# EAGLE design Nixius (EAGLE 7.1.0)
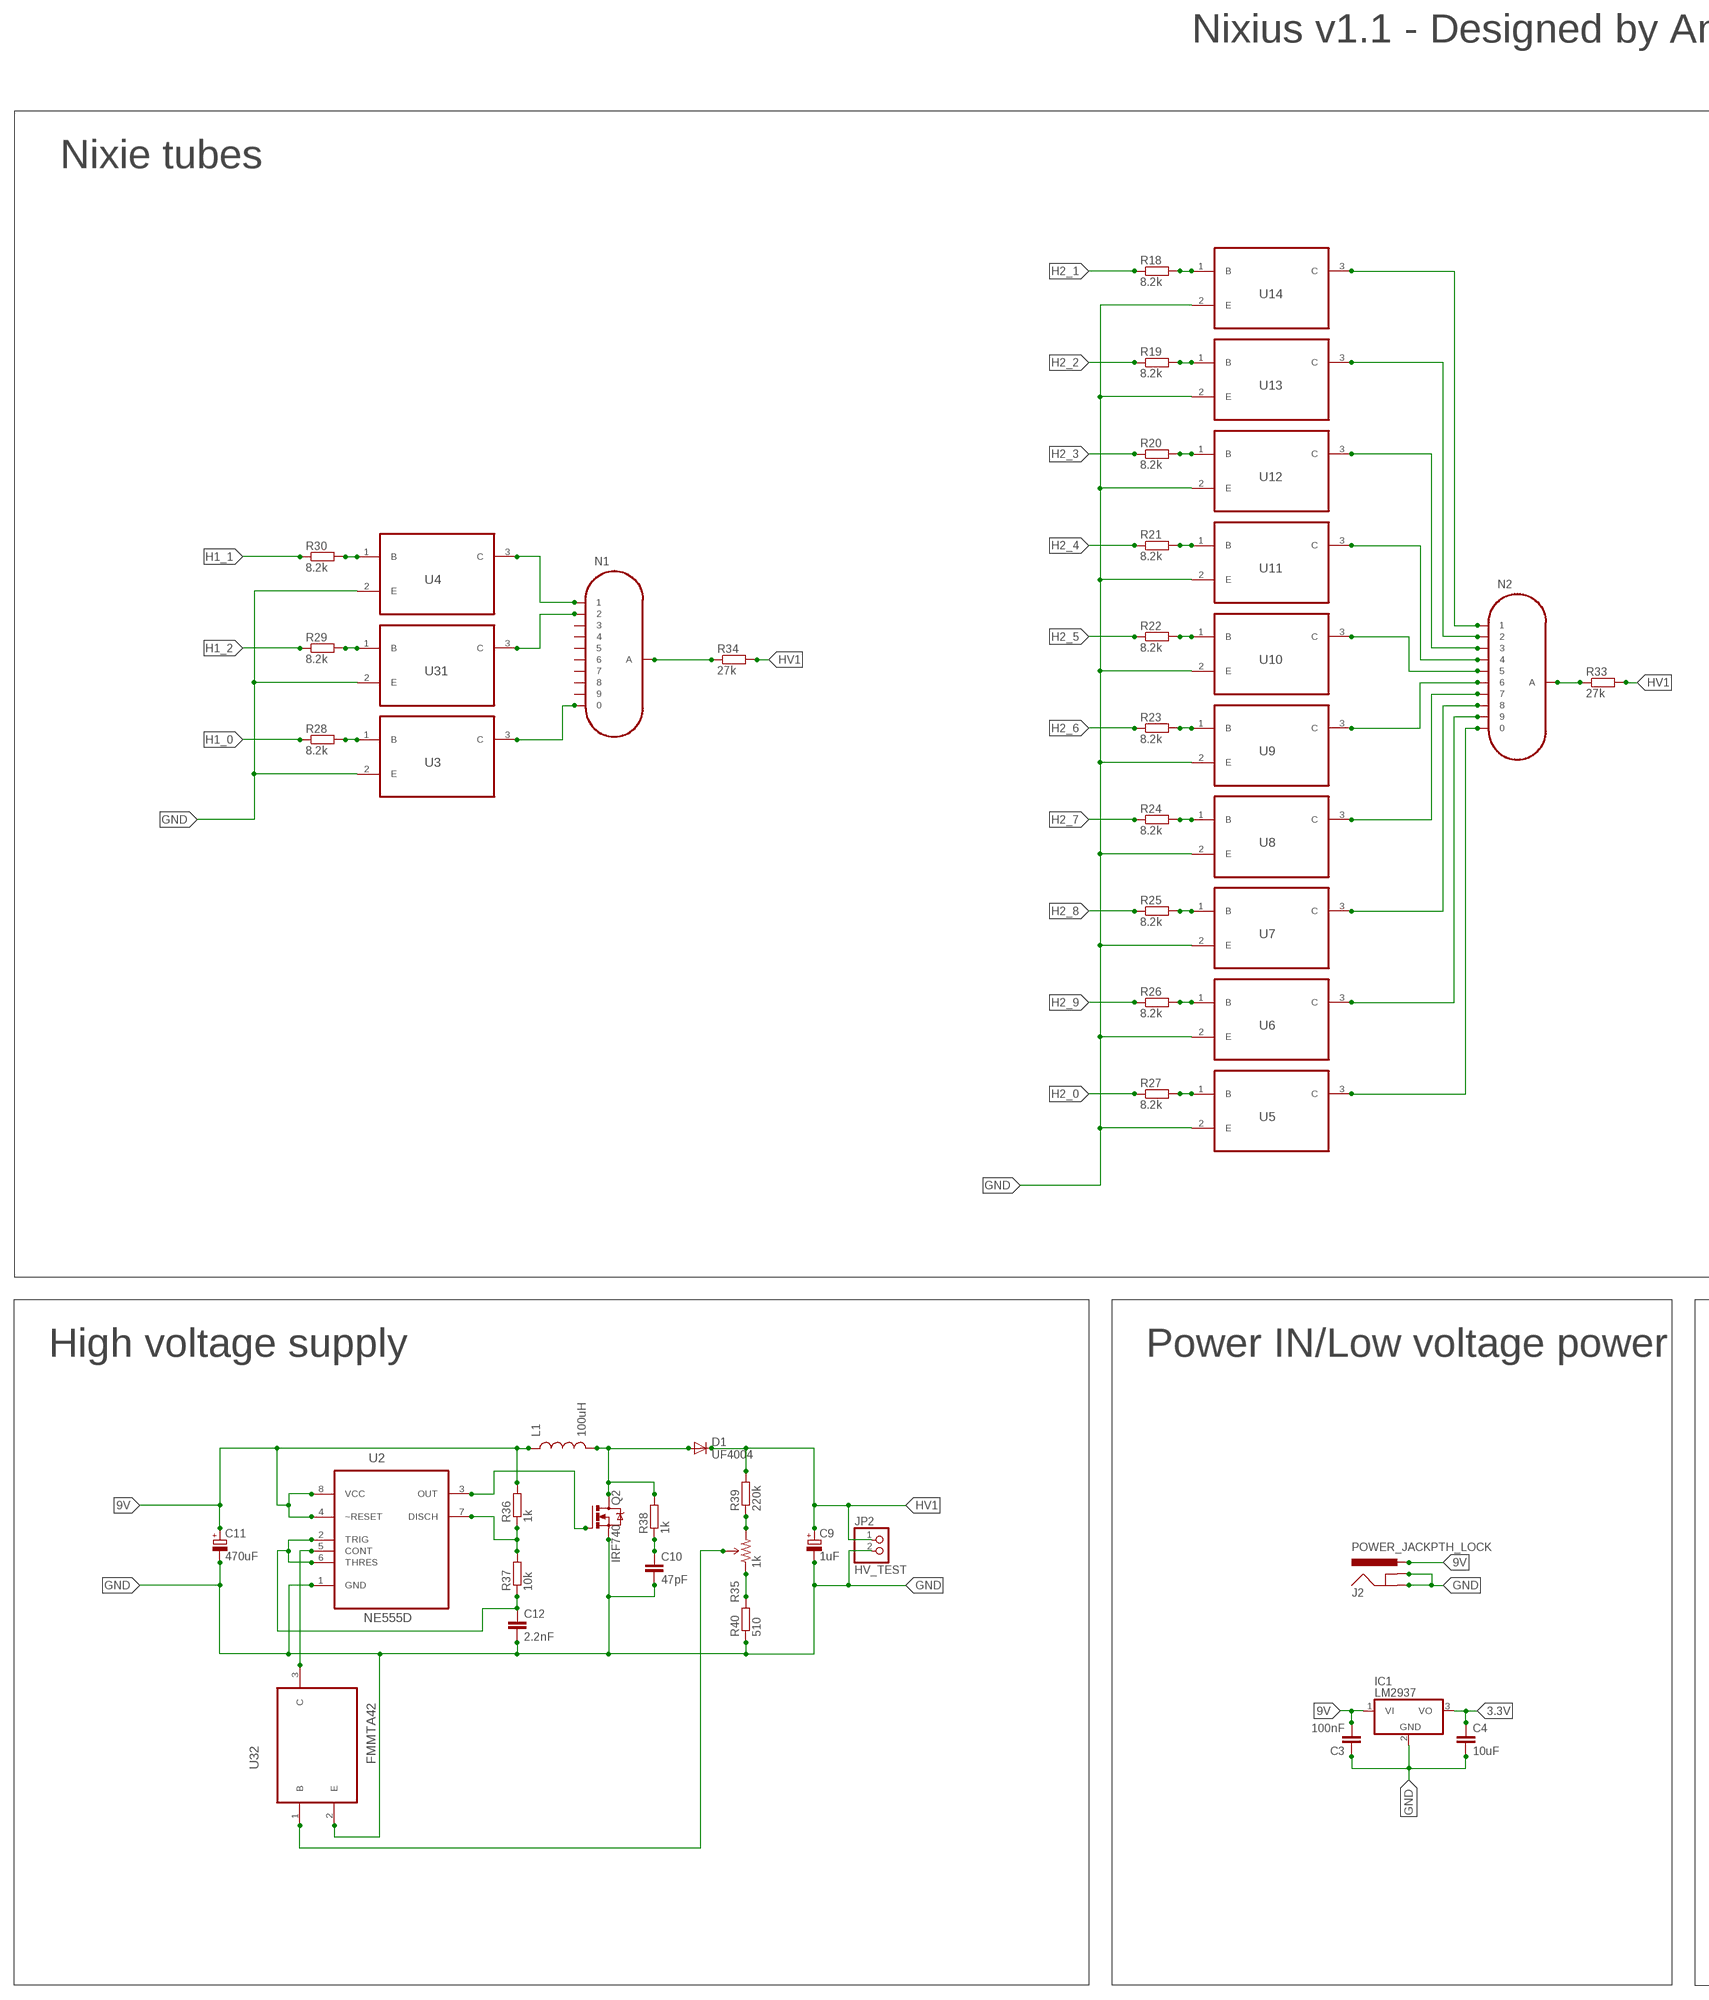
[diagram p0: schematic, sheet 1, part 1 of 2]
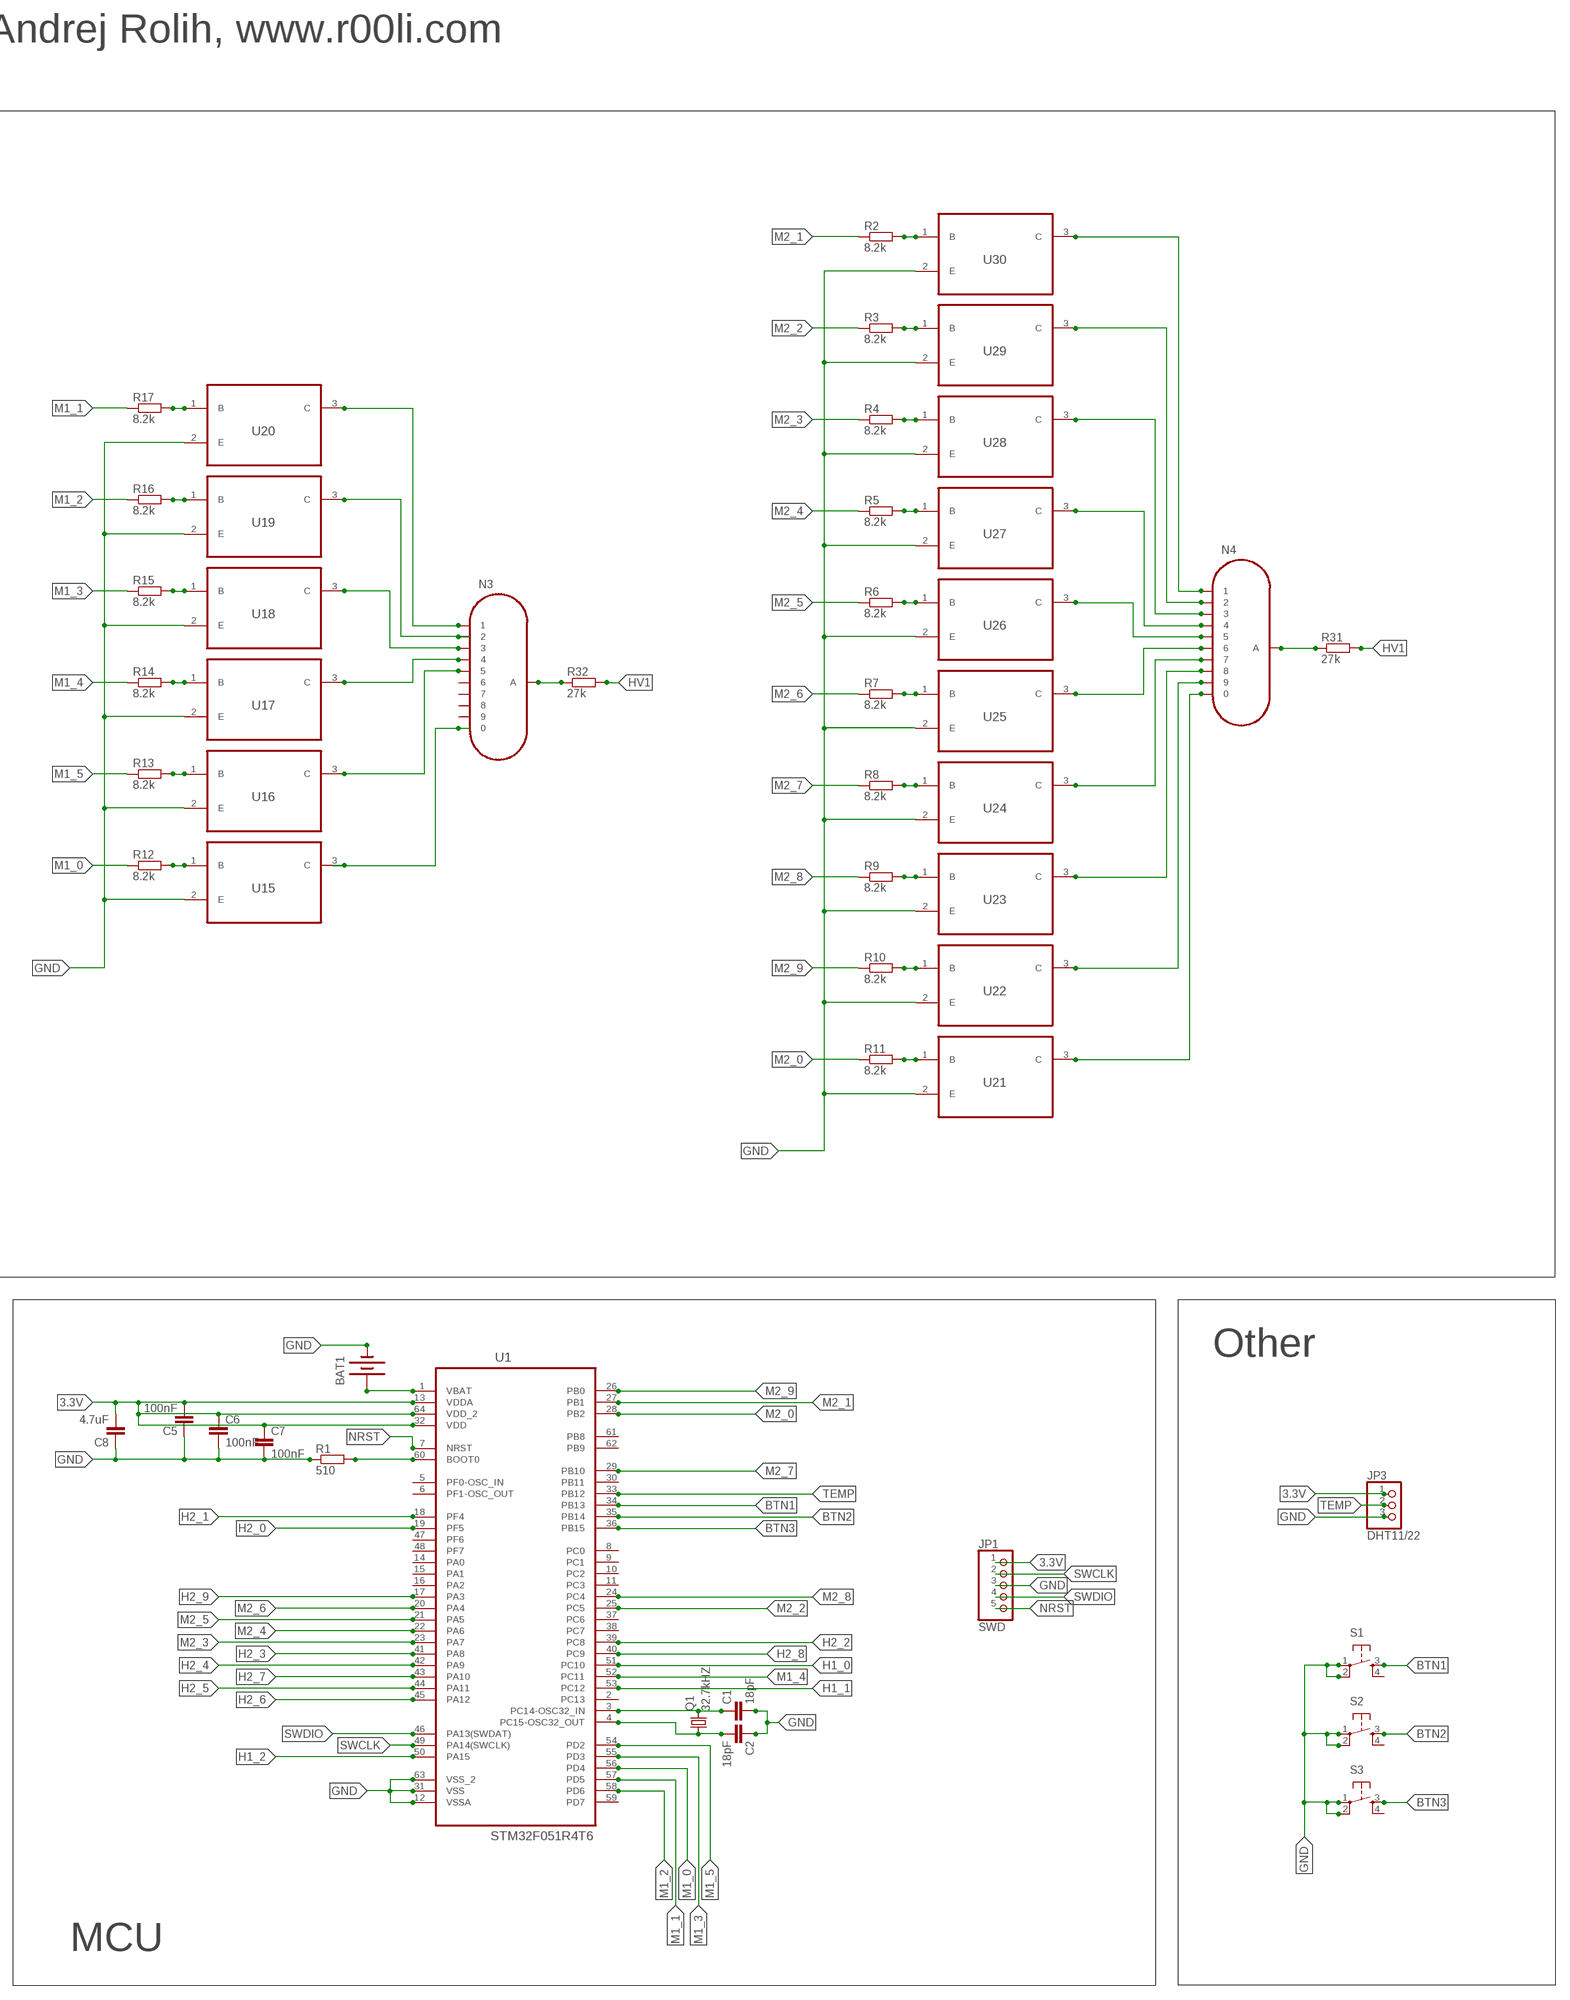
[diagram p1: schematic, sheet 1, part 2 of 2]

## Parts
BAT1  BATTERY20SMD  [BATTCON_20MM]
C1  18pF  CAP0805  [0805]
C2  18pF  CAP0805  [0805]
C3  100nF  CAP0805  [0805]
C4  10uF  CAP0805  [0805]
C5  100nF  CAP0805  [0805]
C6  100nF  CAP0805  [0805]
C7  100nF  CAP0805  [0805]
C8  4.7uF  CAP0805  [0805]
C9  1uF  CPOL-EUE2.5-6  [E2,5-6]
C10  47pF  CAP0805  [0805]
C11  470uF  CPOL-EUE3.5-8  [E3,5-8]
C12  2.2nF  C-EU050-025X075  [C050-025X075]
D1  UF4004  1N4004  [DO41-10]
IC1  LM2937  [TO263-3]
J2  POWER_JACKPTH_LOCK  [POWER_JACK_PTH_LOCK]
JP1  SWD  PINHD-1X5  [1X05]
JP2  HV_TEST  PINHD-1X2  [1X02]
JP3  DHT11/22  PINHD-1X3  [1X03]
L1  100uH  INDUCTORRLB0912  [RLB0912]
N1  IN-1  [IN-1]
N2  IN-1  [IN-1]
N3  IN-1  [IN-1]
N4  IN-1  [IN-1]
Q1  32.7kHZ  MC-306  [MC-306]
Q2  IRF740  [TO220BV]
R1  510  R-EU_R0805  [R0805]
R2  8.2k  R-EU_R0805  [R0805]
R3  8.2k  R-EU_R0805  [R0805]
R4  8.2k  R-EU_R0805  [R0805]
R5  8.2k  R-EU_R0805  [R0805]
R6  8.2k  R-EU_R0805  [R0805]
R7  8.2k  R-EU_R0805  [R0805]
R8  8.2k  R-EU_R0805  [R0805]
R9  8.2k  R-EU_R0805  [R0805]
R10  8.2k  R-EU_R0805  [R0805]
R11  8.2k  R-EU_R0805  [R0805]
R12  8.2k  R-EU_R0805  [R0805]
R13  8.2k  R-EU_R0805  [R0805]
R14  8.2k  R-EU_R0805  [R0805]
R15  8.2k  R-EU_R0805  [R0805]
R16  8.2k  R-EU_R0805  [R0805]
R17  8.2k  R-EU_R0805  [R0805]
R18  8.2k  R-EU_R0805  [R0805]
R19  8.2k  R-EU_R0805  [R0805]
R20  8.2k  R-EU_R0805  [R0805]
R21  8.2k  R-EU_R0805  [R0805]
R22  8.2k  R-EU_R0805  [R0805]
R23  8.2k  R-EU_R0805  [R0805]
R24  8.2k  R-EU_R0805  [R0805]
R25  8.2k  R-EU_R0805  [R0805]
R26  8.2k  R-EU_R0805  [R0805]
R27  8.2k  R-EU_R0805  [R0805]
R28  8.2k  R-EU_R0805  [R0805]
R29  8.2k  R-EU_R0805  [R0805]
R30  8.2k  R-EU_R0805  [R0805]
R31  27k  R-EU_R1206  [R1206]
R32  27k  R-EU_R1206  [R1206]
R33  27k  R-EU_R1206  [R1206]
R34  27k  R-EU_R1206  [R1206]
R35  1k  TRIMPOT3362U-2  [3362U-2]
R36  1k  R-EU_R0805  [R0805]
R37  10k  R-EU_R0805  [R0805]
R38  1k  R-EU_R0805  [R0805]
R39  220k  R-EU_R1206  [R1206]
R40  510  R-EU_R0805  [R0805]
S1  TAC_SWITCHPTH  [TACTILE-PTH]
S2  TAC_SWITCHPTH  [TACTILE-PTH]
S3  TAC_SWITCHPTH  [TACTILE-PTH]
U1  STM32F051R4T6  [QFP50P1200X1200X160-64N]
U2  NE555D  [SOIC127P600X175-8N]
U3  FMMTA42  [SOT95P240X110-3N]
U4  FMMTA42  [SOT95P240X110-3N]
U5  FMMTA42  [SOT95P240X110-3N]
U6  FMMTA42  [SOT95P240X110-3N]
U7  FMMTA42  [SOT95P240X110-3N]
U8  FMMTA42  [SOT95P240X110-3N]
U9  FMMTA42  [SOT95P240X110-3N]
U10  FMMTA42  [SOT95P240X110-3N]
U11  FMMTA42  [SOT95P240X110-3N]
U12  FMMTA42  [SOT95P240X110-3N]
U13  FMMTA42  [SOT95P240X110-3N]
U14  FMMTA42  [SOT95P240X110-3N]
U15  FMMTA42  [SOT95P240X110-3N]
U16  FMMTA42  [SOT95P240X110-3N]
U17  FMMTA42  [SOT95P240X110-3N]
U18  FMMTA42  [SOT95P240X110-3N]
U19  FMMTA42  [SOT95P240X110-3N]
U20  FMMTA42  [SOT95P240X110-3N]
U21  FMMTA42  [SOT95P240X110-3N]
U22  FMMTA42  [SOT95P240X110-3N]
U23  FMMTA42  [SOT95P240X110-3N]
U24  FMMTA42  [SOT95P240X110-3N]
U25  FMMTA42  [SOT95P240X110-3N]
U26  FMMTA42  [SOT95P240X110-3N]
U27  FMMTA42  [SOT95P240X110-3N]
U28  FMMTA42  [SOT95P240X110-3N]
U29  FMMTA42  [SOT95P240X110-3N]
U30  FMMTA42  [SOT95P240X110-3N]
U31  FMMTA42  [SOT95P240X110-3N]
U32  FMMTA42  [SOT95P240X110-3N]

## Nets
3.3V: C4.1 C5.2 C6.1 C7.1 C8.2 IC1.3(VO) JP1.1 JP3.1 U1.13(VDDA) U1.32(VDD) U1.64(VDD_2)
9V: C3.2 C11.+ IC1.1(VI) J2.PWR L1.1 R36.2 U2.4(~RESET) U2.8(VCC)
BTN1: S1.3 U1.34(PB13)
BTN2: S2.3 U1.35(PB14)
BTN3: S3.3 U1.36(PB15)
GND: BAT1.2(-) C1.2 C2.1 C3.1 C4.2 C5.1 C6.2 C7.2 C8.1 C9.- C10.2 C11.- C12.2 IC1.2(GND) J2.GND J2.GNDBREAK JP1.3 JP2.2 JP3.3 Q2.S R1.1 R40.1 S1.1 S1.2 S2.1 S2.2 S3.1 S3.2 U1.12(VSSA) U1.31(VSS) U1.63(VSS_2) U2.1(GND) U3.2(E) U4.2(E) U5.2(E) U6.2(E) U7.2(E) U8.2(E) U9.2(E) U10.2(E) U11.2(E) U12.2(E) U13.2(E) U14.2(E) U15.2(E) U16.2(E) U17.2(E) U18.2(E) U19.2(E) U20.2(E) U21.2(E) U22.2(E) U23.2(E) U24.2(E) U25.2(E) U26.2(E) U27.2(E) U28.2(E) U29.2(E) U30.2(E) U31.2(E) U32.2(E)
H1_0: R28.1 U1.51(PC10)
H1_1: R30.1 U1.53(PC12)
H1_2: R29.1 U1.50(PA15)
H2_0: R27.1 U1.19(PF5)
H2_1: R18.1 U1.18(PF4)
H2_2: R19.1 U1.39(PC8)
H2_3: R20.1 U1.41(PA8)
H2_4: R21.1 U1.42(PA9)
H2_5: R22.1 U1.44(PA11)
H2_6: R23.1 U1.45(PA12)
H2_7: R24.1 U1.43(PA10)
H2_8: R25.1 U1.40(PC9)
H2_9: R26.1 U1.17(PA3)
HV1: C9.+ D1.C JP2.1 R31.2 R32.2 R33.2 R34.2 R39.2
M1_0: R12.1 U1.56(PD4)
M1_1: R17.1 U1.57(PD5)
M1_2: R16.1 U1.58(PD6)
M1_3: R15.1 U1.55(PD3)
M1_4: R14.1 U1.52(PC11)
M1_5: R13.1 U1.54(PD2)
M2_0: R11.1 U1.28(PB2)
M2_1: R2.1 U1.27(PB1)
M2_2: R3.1 U1.25(PC5)
M2_3: R4.1 U1.23(PA7)
M2_4: R5.1 U1.22(PA6)
M2_5: R6.1 U1.21(PA5)
M2_6: R7.1 U1.20(PA4)
M2_7: R8.1 U1.29(PB10)
M2_8: R9.1 U1.24(PC4)
M2_9: R10.1 U1.26(PB0)
N$1: N1.0 U3.3(C)
N$2: N1.2 U31.3(C)
N$3: N1.1 U4.3(C)
N$4: N2.0 U5.3(C)
N$5: N2.9 U6.3(C)
N$6: N2.8 U7.3(C)
N$7: N2.7 U8.3(C)
N$8: N2.6 U9.3(C)
N$9: N2.5 U10.3(C)
N$10: N2.4 U11.3(C)
N$11: N2.3 U12.3(C)
N$12: N2.2 U13.3(C)
N$13: N2.1 U14.3(C)
N$14: N3.0 U15.3(C)
N$15: N3.5 U16.3(C)
N$16: N3.4 U17.3(C)
N$17: N3.3 U18.3(C)
N$18: N3.2 U19.3(C)
N$19: N3.1 U20.3(C)
N$20: N4.0 U21.3(C)
N$21: N4.9 U22.3(C)
N$22: N4.8 U23.3(C)
N$23: N4.7 U24.3(C)
N$24: N4.6 U25.3(C)
N$25: N4.5 U26.3(C)
N$26: N4.4 U27.3(C)
N$27: N4.3 U28.3(C)
N$28: N4.2 U29.3(C)
N$29: N4.1 U30.3(C)
N$30: BAT1.1(+) U1.1(VBAT)
N$31: C1.1 Q1.4 U1.3(PC14-OSC32_IN)
N$32: C2.2 Q1.1 U1.4(PC15-OSC32_OUT)
N$33: R1.2 U1.60(BOOT0)
N$34: R30.2 U4.1(B)
N$35: R29.2 U31.1(B)
N$36: R28.2 U3.1(B)
N$37: R18.2 U14.1(B)
N$38: R19.2 U13.1(B)
N$39: R20.2 U12.1(B)
N$40: R21.2 U11.1(B)
N$41: R22.2 U10.1(B)
N$42: R23.2 U9.1(B)
N$43: R24.2 U8.1(B)
N$44: R25.2 U7.1(B)
N$45: R26.2 U6.1(B)
N$46: R27.2 U5.1(B)
N$47: R17.2 U20.1(B)
N$48: R16.2 U19.1(B)
N$49: R15.2 U18.1(B)
N$50: R14.2 U17.1(B)
N$51: R13.2 U16.1(B)
N$52: R12.2 U15.1(B)
N$53: R2.2 U30.1(B)
N$54: R3.2 U29.1(B)
N$55: R4.2 U28.1(B)
N$56: R5.2 U27.1(B)
N$57: R6.2 U26.1(B)
N$58: R7.2 U25.1(B)
N$59: R8.2 U24.1(B)
N$60: R9.2 U23.1(B)
N$61: R10.2 U22.1(B)
N$62: R11.2 U21.1(B)
N$63: N1.A R34.1
N$64: N3.A R32.1
N$67: R36.1 R37.2 U2.7(DISCH)
N$68: U2.5(CONT) U32.3(C)
N$69: C12.1 R37.1 U2.2(TRIG) U2.6(THRES)
N$70: Q2.G U2.3(OUT)
N$71: D1.A L1.2 Q2.D R38.2
N$73: C10.1 R38.1
N$74: R35.3(CW) R39.1
N$75: R35.1(CCW) R40.2
N$76: N2.A R33.1
N$77: R35.2(WIPER) U32.1(B)
N$83: N4.A R31.1
NRST: JP1.5 U1.7(NRST)
SWCLK: JP1.2 U1.49(PA14(SWCLK))
SWDIO: JP1.4 U1.46(PA13(SWDAT))
TEMP: JP3.2 U1.33(PB12)
Unconnected: N1.3 N1.4 N1.5 N1.6 N1.7 N1.8 N1.9 N3.6 N3.7 N3.8 N3.9 S1.4 S2.4 S3.4 U1.2(PC13) U1.5(PF0-OSC_IN) U1.6(PF1-OSC_OUT) U1.8(PC0) U1.9(PC1) U1.10(PC2) U1.11(PC3) U1.14(PA0) U1.15(PA1) U1.16(PA2) U1.30(PB11) U1.37(PC6) U1.38(PC7) U1.47(PF6) U1.48(PF7) U1.59(PD7) U1.61(PB8) U1.62(PB9)

## Notes on the sheet
- Nixius v1.1 - Designed by Andrej Rolih, www.r00li.com
- Nixie tubes
- High voltage supply | Power IN/Low voltage power | Other
- MCU

## Library data of the parts
BAT1 = SparkFun-Electromechanical:BATTERY: Battery Holders Various common sizes : AA, AAA, 20mm coin cell and 12mm coin cell. 20MM_4LEGS, BATT-10373
C1-C8 C10 = SparkFun-Capacitors:CAP: Capacitor Standard 0603 ceramic capacitor, and 0.1" leaded capacitor.
C9 C11 = rcl:CPOL-EU: POLARIZED CAPACITOR, European symbol
C12 = rcl:C-EU: CAPACITOR, European symbol
D1 = diode:1N4004: DIODE general purpose rectifier, 1 A
IC1 = linear:LM2937: LM2937-2.5, LM2937-3.3 400mA and 500mA Voltage Regulators Source: http://cache.national.com/ds/LM/LM2937-2.5.pdf
J2 = SparkFun-Connectors:POWER_JACK: Power Jack This is the standard 5.5mm barrel jack for power. The PTH is the most common, proven, reliable, footprint. The Slot footprint only works if the mill layer is transmitted to the PCB fab house so be warned. Mating wall wart : TOL-00298 (and others); PROD_ID: PRT-00119
JP1 = pinhead:PINHD-1X5: PIN HEADER
JP2 = pinhead:PINHD-1X2: PIN HEADER
JP3 = pinhead:PINHD-1X3: PIN HEADER
L1 = SparkFun-Passives:INDUCTOR: Inductors Basic Inductor/Choke - 0603 and 1206. Footprints are not proven and vary greatly between part numbers. SRN6045- 33uH, 20% 1.4A SDR0403-560KL - 56uH, 10%, 500mA RMS/740mA peak
N1-N4 = russian-nixies:IN-1: IN-1: large numeric topview nixie tube
Q1 = crystal:MC-306: kHz RANGE CRYSTAL UNIT SMD Source: MC-306_405_406_E07X.PDF Homepage <http://www.epsontoyocom.co.jp>; MPN: MC-306 60.0KHZ 100PPM ,12.5PF; OC_FARNELL: 1278040; OC_NEWARK: 31M5576
Q2 = transistor-power:IRF740: N-CHANNEL MOS FET
R1-R34 R36-R38 R40 = resistor:R-EU_: RESISTOR, European symbol; SPICEPREFIX: R
R35 = SparkFun-Electromechanical:TRIMPOT: Various small potentiometers for "set-and-forget" applications
R39 = rcl:R-EU_: RESISTOR, European symbol
S1-S3 = SparkFun-Electromechanical:TAC_SWITCH: Momentary Switch Button commonly used for reset or general input. Spark Fun Electronics SKU : COM-00097 SMT- SWCH-08247
U1 = STM32F051R4T6:STM32F051R4T6: MCU, 32BIT, ARM CORTEX-M0, 64LQFP; MPN: STM32F051R4T6; OC_FARNELL: 2115069; OC_NEWARK: 05W5806; PACKAGE: 64LQFP; SUPPLIER: STMicroelectronics
U2 = NE555D:NE555D: PRECISION TIMER; MPN: NE555D; OC_FARNELL: 9589880; OC_NEWARK: 08F2512; PACKAGE: 8-SOIC; SUPPLIER: Texas Instruments
U3-U32 = FMMTA42:FMMTA42: NPN Silicon planar high voltage transistor; MPN: FMMTA42; OC_FARNELL: 9526277; OC_NEWARK: 96K9950; PACKAGE: SOT-23-3; SUPPLIER: Diodes Inc

## Board
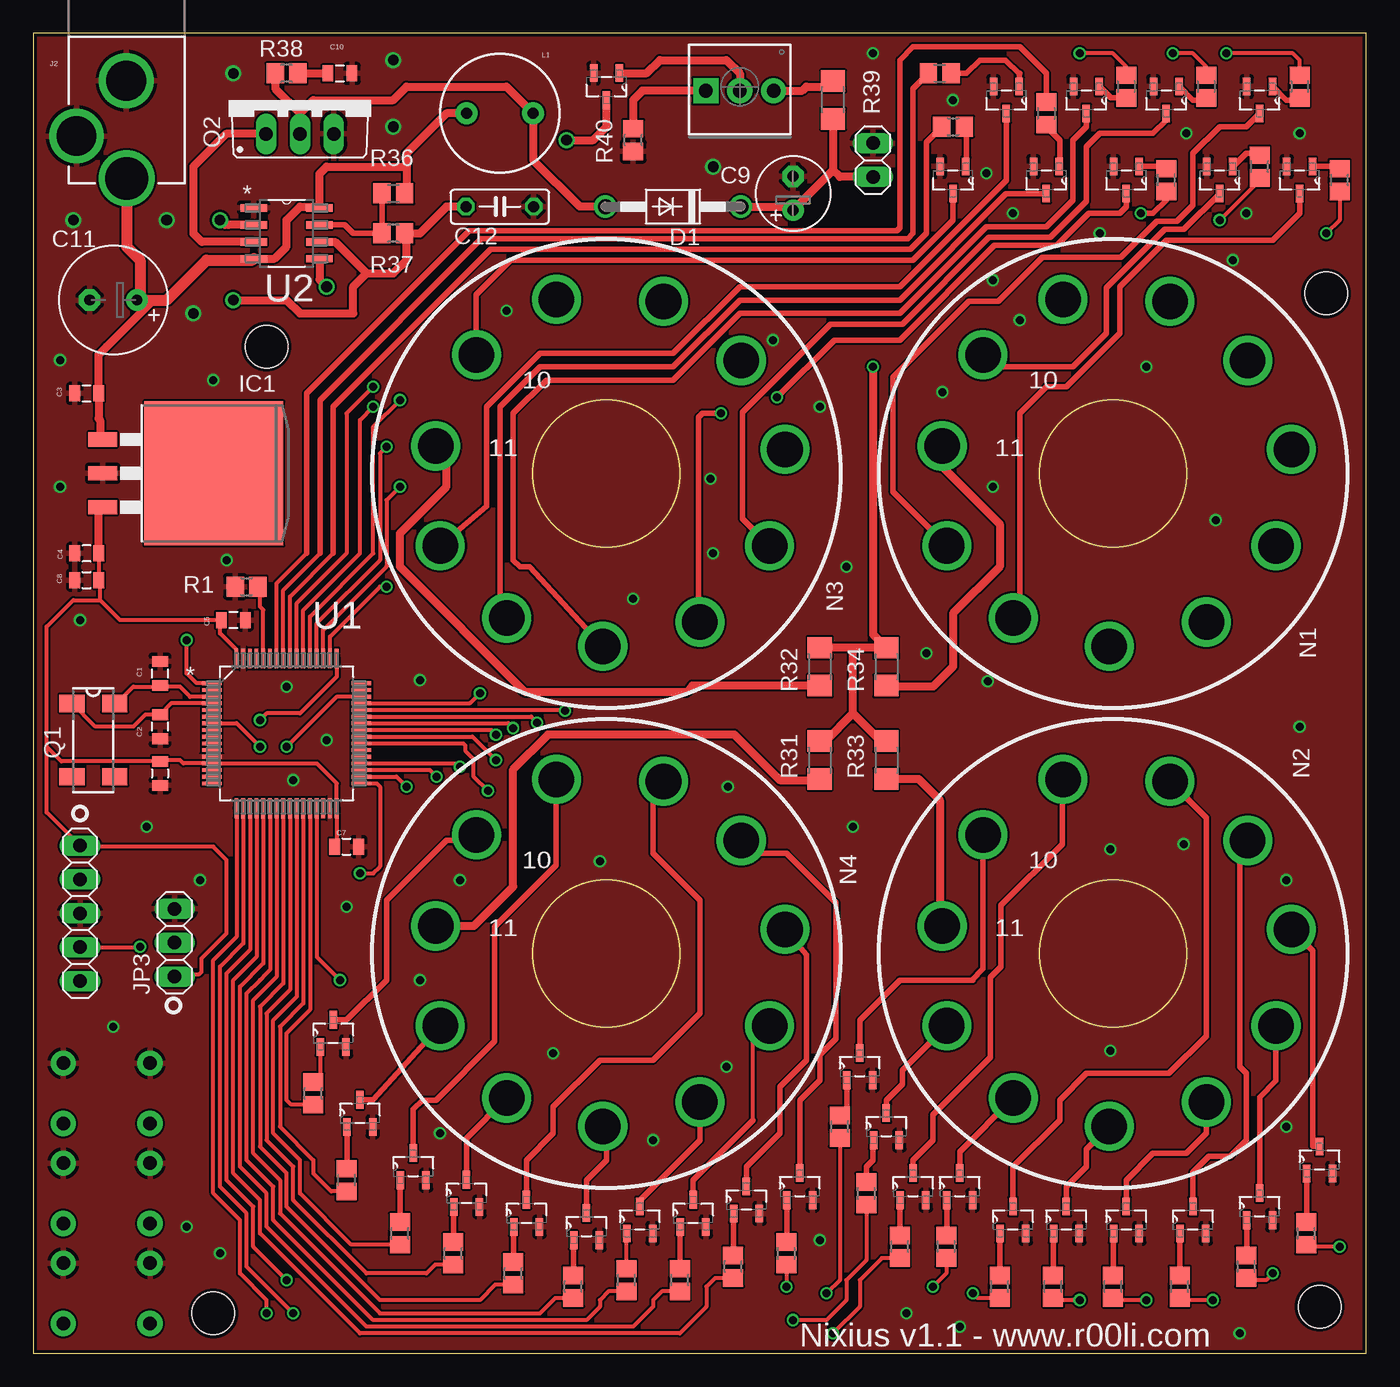
[diagram p2: board, top side]
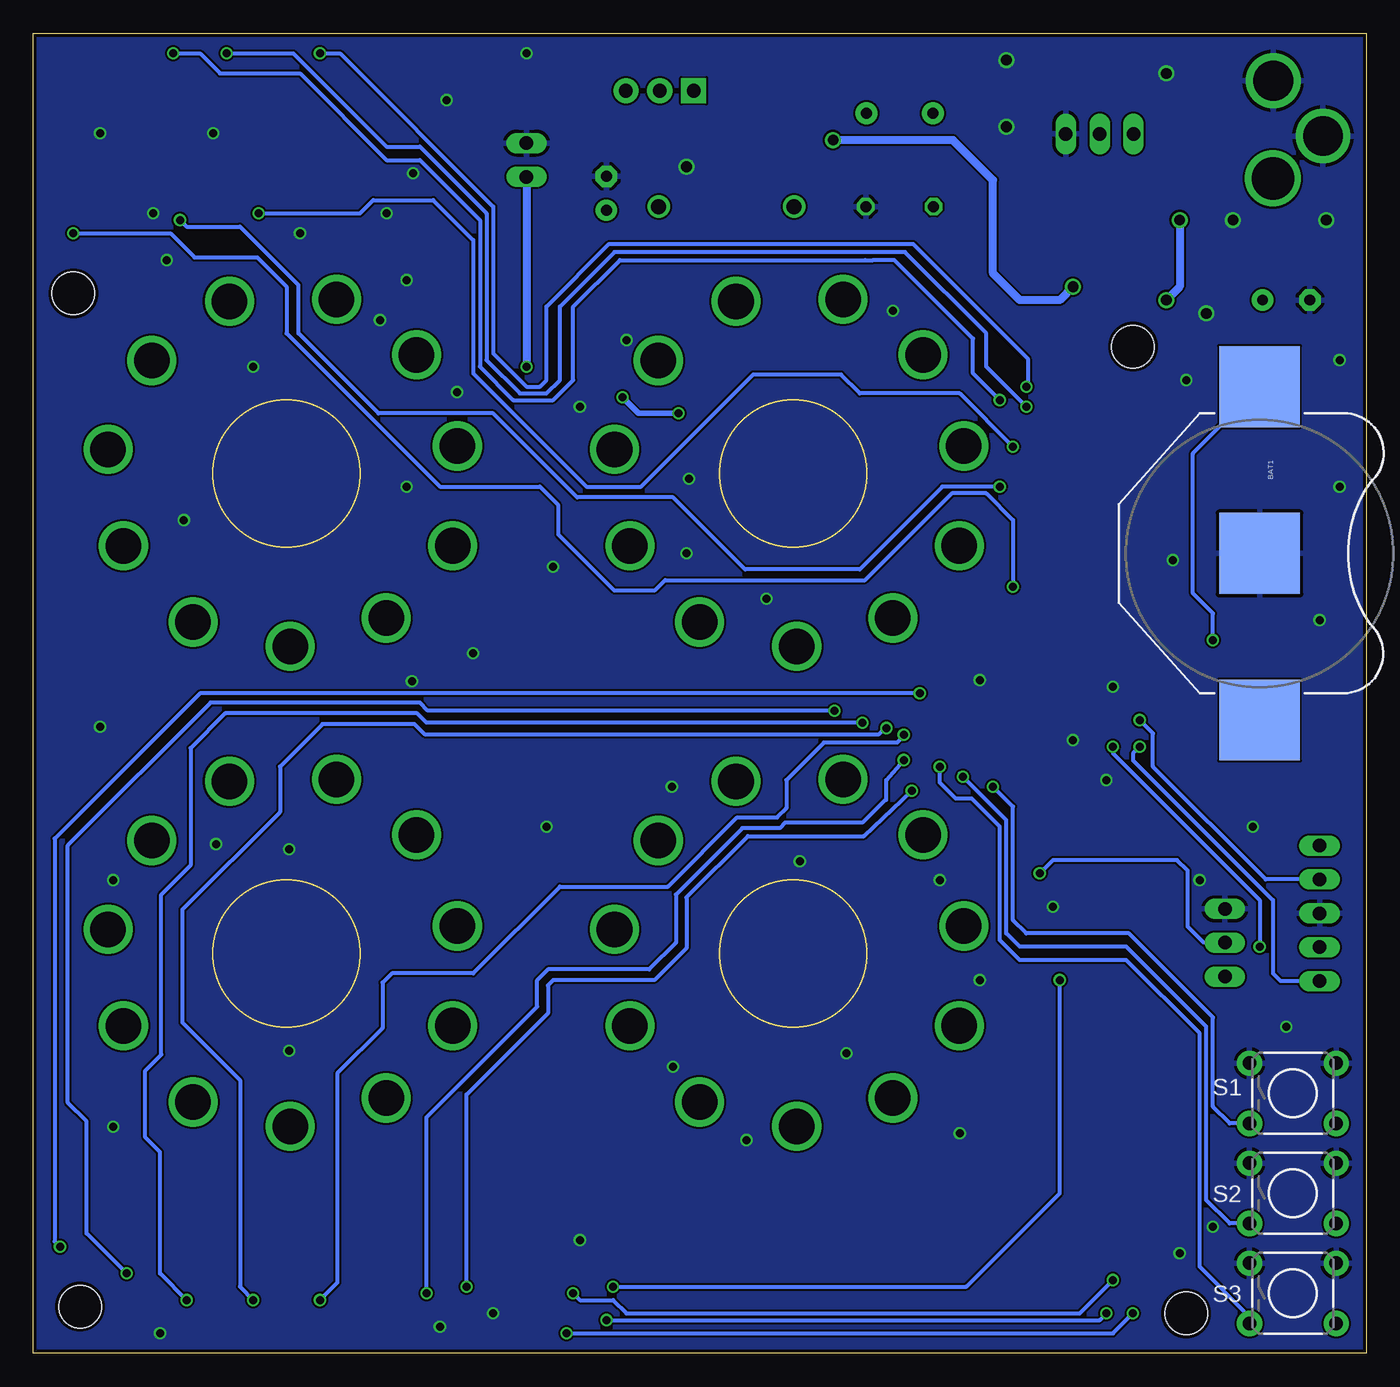
[diagram p3: board, bottom side, seen from below]

Size 100 x 99 mm. Coordinates in mm from the lower left corner, seen from the top.
Outline: 0,0 100,0 100,99 0,99 0,0
Copper layers (1*16): Top 0.035mm / dielectric 1.5mm / Bottom 0.035mm
Design rules "Elecrow_2-layer_eagle_rule": minimum track width 6mil, minimum drill 12mil, track to track 6mil, track to pad 6mil, pad to pad 6mil, via to via 6mil, smd to smd 0mil, copper to edge 10mil, drill to drill 10mil, minimum pad ring 10mil, minimum via ring 6mil, stop-mask expansion 2mil, vias tented up to drill 100mil, thermal gap 10mil
Holes 3.2 mm at 96.5,3.5 13.5,3 97,79.5 17.5,75.5

### Footprints (pad centres in the part's own frame; a part is rotated, then mirrored left to right if it is on the bottom)
BATTCON_20MM = smd 6.07 x 6.07: 1 -12.5,0; 2 0,0; 3 12.5,0
0805 = smd 0.8 x 1.2: 1 -0.9,0; 2 0.9,0
E2,5-6 = drill 0.813 pad 1.6: + -1.27,0 | drill 0.813 pad 1.6 octagon: - 1.27,0
E3,5-8 = drill 0.813 pad 1.6: + -1.778,0 | drill 0.813 pad 1.6 octagon: - 1.778,0
C050-025X075 = drill 0.813 octagon: 1 -2.54,0; 2 2.54,0
DO41-10 = drill 1.118: A 5.08,0; C -5.08,0
TO263-3 = smd 1.067 x 2.159: 1 -2.54,-5.791; 2 0,-5.791; 3 2.54,-5.791 | smd 10.8 x 10.41: TAB 0,2.54
POWER_JACK_PTH_LOCK = drill 2.997 pad 4.115: GND 0.025,6.557; GNDBREAK 3.762,10.7 | drill 3.2 pad 4.115: PWR 0,13.878
1X05 = drill 1.016 long: 1 -5.08,0; 2 -2.54,0; 3 0,0; 4 2.54,0; 5 5.08,0
1X02 = drill 1.016 long: 1 -1.27,0; 2 1.27,0
1X03 = drill 1.016 long: 1 -2.54,0; 2 0,0; 3 2.54,0
RLB0912 = drill 0.813 pad 1.651: 1 2.502,0; 2 -2.502,0
IN-1 = drill 2.667: 0 -9.75,8.882; 1 -12.467,-5.432; 2 -7.48,-10.849; 3 -0.277,-12.98; 4 7.014,-11.149; 5 12.237,-5.436; 6 13.392,1.802; 7 10.113,8.463; 8 4.282,12.896; 9 -3.75,13.052; A -12.813,2.05
MC-306 = smd 1.3 x 1.9: 1 -2.75,-1.6; 2 2.75,-1.6; 3 2.75,1.6; 4 -2.75,1.6
TO220BV = drill 1.016 long: D 0,-2.54; G -2.54,-2.54; S 2.54,-2.54
R0805 = smd 1.3 x 1.5: 1 -0.85,0; 2 0.85,0
R1206 = smd 1.6 x 1.803: 1 -1.422,0; 2 1.422,0
3362U-2 = drill 1.016 pad 1.88 square: 1 -2.54,-0.305 | drill 1.016 pad 1.88: 2 0,-0.305; 3 2.54,-0.305
TACTILE-PTH = drill 1.016 pad 1.88: 1 -3.251,2.261; 2 3.251,2.261; 3 -3.251,-2.261; 4 3.251,-2.261
QFP50P1200X1200X160-64N = smd 1.473 x 0.279: 1 -5.613,3.759; 2 -5.613,3.251; 3 -5.613,2.743; 4 -5.613,2.261; 5 -5.613,1.753; 6 -5.613,1.245; 7 -5.613,0.762; 8 -5.613,0.254; 9 -5.613,-0.254; 10 -5.613,-0.762; 11 -5.613,-1.245; 12 -5.613,-1.753; 13 -5.613,-2.261; 14 -5.613,-2.743; 15 -5.613,-3.251; 16 -5.613,-3.759; 33 5.613,-3.759; 34 5.613,-3.251; 35 5.613,-2.743; 36 5.613,-2.261; 37 5.613,-1.753; 38 5.613,-1.245; 39 5.613,-0.762; 40 5.613,-0.254; 41 5.613,0.254; 42 5.613,0.762; 43 5.613,1.245; 44 5.613,1.753; 45 5.613,2.261; 46 5.613,2.743; 47 5.613,3.251; 48 5.613,3.759 | smd 0.279 x 1.473: 17 -3.759,-5.613; 18 -3.251,-5.613; 19 -2.743,-5.613; 20 -2.261,-5.613; 21 -1.753,-5.613; 22 -1.245,-5.613; 23 -0.762,-5.613; 24 -0.254,-5.613; 25 0.254,-5.613; 26 0.762,-5.613; 27 1.245,-5.613; 28 1.753,-5.613; 29 2.261,-5.613; 30 2.743,-5.613; 31 3.251,-5.613; 32 3.759,-5.613; 49 3.759,5.613; 50 3.251,5.613; 51 2.743,5.613; 52 2.261,5.613; 53 1.753,5.613; 54 1.245,5.613; 55 0.762,5.613; 56 0.254,5.613; 57 -0.254,5.613; 58 -0.762,5.613; 59 -1.245,5.613; 60 -1.753,5.613; 61 -2.261,5.613; 62 -2.743,5.613; 63 -3.251,5.613; 64 -3.759,5.613
SOIC127P600X175-8N = smd 1.981 x 0.559: 1 -2.464,1.905; 2 -2.464,0.635; 3 -2.464,-0.635; 4 -2.464,-1.905; 5 2.464,-1.905; 6 2.464,-0.635; 7 2.464,0.635; 8 2.464,1.905
SOT95P240X110-3N = smd 1.321 x 0.559: 1 -1.016,0.965; 2 -1.016,-0.965; 3 1.016,0

### Placement (x,y rotation side)
BAT1  8,60 270 bottom
C1  9.5,51 90 top
C2  9.5,47 90 top
C3  4,72 0 top
C4  4,60 180 top
C5  15,55 180 top
C6  9.5,43.5 270 top
C7  23.5,38 0 top
C8  4,58 0 top
C9  57,87 90 top
C10  23,96 0 top
C11  6,79 180 top
C12  35,86 0 top
D1  48,86 180 top
IC1  11,66 270 top
J2  7,102 180 top
JP1  3.5,33 270 top
JP2  63,89.5 90 top
JP3  10.6,30.8 90 top
L1  35,93 180 top
N1  81,66 0 top
N2  81,30 0 top
N3  43,66 0 top
N4  43,30 0 top
Q1  4.5,46 270 top
Q2  20,94 0 top
R1  16,57.5 0 top
R2  23.5,13 90 top
R3  31.5,7.5 90 top
R4  40.5,5 90 top
R5  44.5,5.5 90 top
R6  48.5,5.5 90 top
R7  52.5,6.5 90 top
R8  56.5,7.5 90 top
R9  36,6 90 top
R10  27.5,9 90 top
R11  21,19.5 90 top
R12  69,92 0 top
R13  88,95 270 top
R14  85,88 90 top
R15  82,95 270 top
R16  76,93 270 top
R17  68,96 0 top
R18  62.5,12 90 top
R19  68.5,8 90 top
R20  76.5,5 90 top
R21  81,5 90 top
R22  91,6.5 90 top
R23  95.5,9 90 top
R24  86,5 90 top
R25  72.5,5 90 top
R26  65,8 90 top
R27  60.5,17 90 top
R28  92,89 90 top
R29  98,88 90 top
R30  95,95 270 top
R31  59,44.5 90 top
R32  59,51.5 90 top
R33  64,44.5 90 top
R34  64,51.5 90 top
R35  53,95 0 top
R36  27,87 0 top
R37  27,84 180 top
R38  19,96 180 top
R39  60,94 270 top
R40  45,91 90 top
S1  5.5,19.5 0 bottom
S2  5.5,12 0 bottom
S3  5.5,4.5 0 bottom
U1  19,46.5 0 top
U2  19,84 0 top
U3  89,88 270 top
U4  92,94 270 top
U5  62,21.5 90 top
U6  66,12.5 90 top
U7  73.5,10 90 top
U8  87,10 90 top
U9  96.5,14.5 90 top
U10  92,11 90 top
U11  82,10 90 top
U12  77.5,10 90 top
U13  69.5,12.5 90 top
U14  64,17 90 top
U15  69,88 270 top
U16  85,94 270 top
U17  82,88 270 top
U18  79,94 270 top
U19  76,88 270 top
U20  73,94 270 top
U21  22.5,24 90 top
U22  28.5,14 90 top
U23  37,10.5 90 top
U24  57.5,12.5 90 top
U25  53.5,11.5 90 top
U26  49.5,10.5 90 top
U27  45.5,10 90 top
U28  41.5,9.5 90 top
U29  32.5,12 90 top
U30  24.5,18 90 top
U31  95,88 270 top
U32  43,95 270 top

### Tracks (layer width: path | path; a pad name or v marks a point on that pad's centre or on a via)
3.3V
  Top 0.305: C4.1 C8.2 5,57.9 5,56.5 | U1.64 15.24,52.76 14,54 14,54.9 C5.2 6.5,55 5,56.5 | 1,45.5 1,40.58 JP1.1 3.58,38 13.5,38 14.5,37 14.5,31.5 12.6,29.6 12.6,28.6 12.4,28.4 10.74,28.4 JP3.1 | 1,45.5 1,54.5 3,56.5 5,56.5 | C7.1 22.76,38.16 U1.32 22.76,42.74 21.26,44.24 U1.13 11.26,44.24 11,44.5 9.6,44.5 C6.1 2.1,44.4 1,45.5
  Top 0.61: C4.1 4.9,63.15 IC1.3
9V
  Top 0.61: U2.4 18.09,82.09 19,83 19,85 20,86 21.37,86 U2.8 21.46,88.46 22,89 28,89 | L1.1 31,93 28,90 28,89 | 28,89 28,87.15 R36.2 | 10,79 9,79 5.5,75.5 5,75 4.9,74.9 C3.2 4.9,70.1 5,70 5,68.75 IC1.1
  Top 0.813: J2.PWR 7,83 8,82 8,79.22 C11.+ 10,79 13,82 16.44,82 U2.4
BTN1  (via drill 0.6)
  Top 0.305: U1.34 27.25,43.25 v28,42.5
  Bottom 0.305: S1.3 10.24,17.24 11.5,18.5 11.5,25.2 17.8,31.5 25.5,31.5 26.5,32.5 26.5,41 v28,42.5
BTN2  (via drill 0.6)
  Top 0.305: U1.35 29.74,43.76 v30.25,43.25
  Bottom 0.305: 30.5,43.5 v30.25,43.25 27,40 27,31.5 26,30.5 18,30.5 12,24.5 12,11.5 10.24,9.74 S2.3
BTN3  (via drill 0.6)
  Top 0.305: U1.36 31.76,44.24 v32,44
  Bottom 0.305: S3.3 8.75,2.75 12.5,6.5 12.5,24 18,29.5 26,29.5 27.5,31 27.5,39.5 29.6,41.6 30.8,41.6 32,42.8 v32,44
GND  (via drill 0.6, 0.8)
  other vias: 15,96 27,97 27,92 12,78 10,85 3,85 51,89 71.5,88.5 73.5,85.5 80,84 86.5,91.5 91,85.5 95,91.5 90,82 13.5,73 3.5,55 14.5,59.5 2,65 2,74.5 55.5,76 74,77.5 83.5,74 45,56.6 68.2,72.1 69,94 63,97.5 72,80.5 35.5,78.2 88.7,62.5 95,47 11.5,9.5 72,65 50.8,65.6 51,60 61,59 32,35.5 42.5,36.9 52.1,42.5 80.8,37.8 19,50 8.5,39.5 29,50.5 61.5,39.5 71.6,50.4 67,52.5 29,28 30.5,16.5 39,22.5 46.5,16 52,21.5 59,8.5 65.5,3 69.5,2 80.8,22.7 94,17 90.5,1.5 59,71 86.3,38.2 23.5,33.5 12.5,35.5 94,35.5 22,46 6,24.5 14,7.5 19.5,43
  pour Bottom: -1,100 101,100 101,-1 -1,-1
  pour Top: -1,100 101,100 101,-1 -1,-1
H1_0  (via drill 0.6)
  Top 0.305: R28.1 92,88 v89,85 | v27.5,65 26.5,64 26.5,59 21.74,54.24 U1.51
  Bottom 0.305: v89,85 88.5,84.5 84.5,84.5 80.1,80.1 80.1,76.5 74.1,70.5 65.5,70.5 59.2,64.2 52,64.2 46.6,58.8 38,58.8 31.8,65 v27.5,65
H1_1  (via drill 0.6)
  Top 0.305: R30.1 95,97 94.5,97.5 v89.5,97.5 | U1.53 20.75,55.25 25.5,60 25.5,69.5 v27.5,71.5
  Bottom 0.305: v89.5,97.5 87.5,97.5 86,96 80,96 73.5,89.5 71,89.5 66.5,85 66.5,74 64,71.5 61,71.5 59.5,73 59.5,78.5 56,82 37.6,82 37,82 35.4,82 29.5,76.1 29.5,73.5 v27.5,71.5
H1_2  (via drill 0.6)
  Top 0.305: R29.1 98,85 v97,84 | U1.50 22.25,53.75 26,57.5 v26.5,57.5
  Bottom 0.305: v97,84 89.7,84 87.9,82.2 83.2,82.2 81,80 81,76.5 69.5,65 62,65 60.6,63.6 60.6,61.4 56.4,57.2 53.4,57.2 52.6,58 37.6,58 31.1,64.5 28.5,64.5 26.5,62.5 v26.5,57.5
H2_0  (via drill 0.6)
  Top 0.305: R27.1 60.5,5.5 v59.5,4.5 | v19,5.5 16.5,8 16.5,11 14.5,13 14.5,28.5 16.26,30.26 U1.19
  Bottom 0.305: v59.5,4.5 59,4 56.5,4 55.5,3 21.5,3 v19,5.5
H2_1  (via drill 0.6)
  Top 0.305: R18.1 62.5,7 61,5.5 61,4 59.5,2.5 v57,2.5 | v19.5,3 16,6.5 16,10.5 14,12.5 14,29 15.75,30.75 U1.18
  Bottom 0.305: v57,2.5 20,2.5 v19.5,3
H2_2  (via drill 0.6)
  Top 0.305: R19.1 68.5,6 v67.5,5 | U1.39 32.26,45.74 32.4,45.6 32.4,45.2 33,44.6 33,43.3 v34.1,42.2
  Bottom 0.305: v67.5,5 67.5,19.4 61.4,25.5 61.4,27.6 61,28 53.4,28 51,30.4 51,34.2 46.4,38.8 37.7,38.8 v34.1,42.2
H2_3  (via drill 0.6)
  Top 0.305: U1.41 34.35,46.75 v34.7,46.4 | v78.5,4 76.65,4 R20.1
  Bottom 0.305: v78.5,4 78.15,4.35 78,4.5 77.2,5.3 77.2,21 73.8,24.4 73.8,27.8 73.1,28.5 67,28.5 60.5,35 52.4,35 47.2,40.2 44.2,40.2 43.5,40.9 43.5,43 40.7,45.8 35.2,45.8 34.7,46.3 v34.7,46.4
H2_4  (via drill 0.6)
  Top 0.305: U1.42 35.64,47.26 v36,46.9 | v83.5,4 81.15,4 R21.1
  Bottom 0.305: v83.5,4 84.5,5 84.5,20.5 88.8,24.8 88.8,33.3 81.5,40.6 81.5,44 78.3,47.2 71.4,47.2 70.6,46.4 36.6,46.4 36.1,46.9 v36,46.9
H2_5  (via drill 0.6)
  Top 0.305: U1.44 39.85,48.25 v39.9,48.2 | v93,6 92.5,5.5 91.15,5.5 R22.1
  Bottom 0.305: v93,6 96,9 96,17.4 97.4,18.8 97.4,38.1 86.7,48.8 71,48.8 70.4,48.2 v39.9,48.2
H2_6  (via drill 0.6)
  Top 0.305: v98,8 95.65,8 R23.1 | U1.45 32.76,48.76 v33.5,49.5
  Bottom 0.305: v33.5,49.5 87.5,49.5 98.4,38.6 98.4,8.4 v98,8
H2_7  (via drill 0.6)
  Top 0.305: U1.43 37.35,47.74 v37.8,47.3 | v88.5,4 86.15,4 R24.1
  Bottom 0.305: v88.5,4 90.5,6 90.5,15.1 91.6,16.2 91.6,21.2 90.4,22.4 90.4,34.4 88.2,36.6 88.2,45.4 85.6,48 71.2,48 70.5,47.3 v37.8,47.3
H2_8  (via drill 0.6)
  Top 0.305: R25.1 70.85,4.15 v70.5,4.5 | U1.40 32.95,46.25 v34.7,44.5
  Bottom 0.305: v70.5,4.5 70.5,17.7 62.2,26 62.2,28 61.4,28.8 53.8,28.8 51.8,30.8 51.8,34.4 46.8,39.4 44,39.4 43.6,39.8 37.8,39.8 36.1,41.5 36,41.5 36,43 v34.7,44.5
H2_9  (via drill 0.6)
  Top 0.305: R26.1 63.65,7.15 62,5.5 62,3.5 v60,1.5 | v17.5,3 17.5,4 15.5,6 15.5,10 13.5,12 13.5,29.5 15.24,31.24 U1.17
  Bottom 0.305: v60,1.5 19,1.5 v17.5,3
HV1  (via drill 0.6)
  Top 0.61: R39.2 60,88.73 | 60,88.73 C9.+ 56.73,86 D1.C | JP2.1 60.5,88.23 60,88.73 | v63,74 63,53.92 R34.2 61.5,52.92 | 61.5,52.92 R32.2 | R33.2 63.58,45.92 61.5,48 | 61.5,48 61.5,52.92 | R31.2 59.42,45.92 61.5,48
  Bottom 0.61: JP2.1 v63,74
M1_0
  Top 0.305: 22.5,60 19.25,56.75 U1.56
  Top 0.406: R12.1 67,90.85 67,84 65.8,82.8 34.3,82.8 22.5,71 22.5,60
M1_1
  Top 0.305: U1.57 18.75,57.25 21.5,60
  Top 0.406: 21.5,60 21.5,71.5 33.6,83.6 65.6,83.6 66,84 66,94.85 R17.1
M1_2
  Top 0.305: U1.58 18.24,57.74 20.5,60
  Top 0.406: R16.1 76,96 74,98 66,98 65,97 65,84.4 64.8,84.2 32.7,84.2 20.5,72 20.5,60
M1_3  (via drill 0.6)
  Top 0.305: R15.1 82,96.5 81,97.5 v78.5,97.5 | U1.55 19.76,56.26 23.5,60 23.5,70.5 v25.5,72.5
  Bottom 0.305: v78.5,97.5 77,97.5 65.5,86 65.5,75 63,72.5 62,72.5 61.5,73 61.5,78.5 56.8,83.2 34,83.2 25.4,74.6 25.4,72.6 v25.5,72.5
M1_4  (via drill 0.6)
  Top 0.305: R14.1 85,86.5 | v26.5,68 26,67.5 26,59.5 21.26,54.76 U1.52
  Top 0.406: 85,86.5 84,85.5 v83.1,85.5
  Bottom 0.305: v83.1,85.5 75.5,85.5 74.5,86.5 70,86.5 67,83.5 67,73.5 58.5,65 54.4,65 46,73.4 39.4,73.4 38,72 30.5,72 v26.5,68
M1_5  (via drill 0.6)
  Top 0.305: R13.1 88,96.5 87,97.5 v85.5,97.5 | U1.54 20.25,55.74 24.5,60 24.5,70 v25.5,71
  Bottom 0.305: v85.5,97.5 80.5,97.5 73.5,90.5 71,90.5 66,85.5 66,74.5 63.5,72 61.5,72 60.5,73 60.5,78.5 56.4,82.6 34.6,82.6 28.5,76.5 28.5,74 v25.5,71
M2_0
  Top 0.305: U1.28 20.75,25.75 19,24 19,19 19.35,18.65 R11.1
M2_1
  Top 0.305: R2.1 22.35,12.15 21,13.5 21,14.5 18.5,17 18.5,24.5 20.25,26.25 U1.27
M2_2
  Top 0.305: R3.1 30.15,6.65 29.5,6 25,6 19.5,11.5 19.5,14 17.5,16 17.5,25.5 19.25,27.25 U1.25
M2_3
  Top 0.305: R4.1 39.15,4.15 38,3 26,3 18.5,10.5 18.5,13 16.5,15 16.5,26.5 18.24,28.24 U1.23
M2_4
  Top 0.305: R5.1 43.15,4.65 42.5,4 42.5,3.5 41.5,2.5 25.5,2.5 18,10 18,12.5 16,14.5 16,27 17,28 17.5,28.5 17.75,28.75 U1.22
M2_5
  Top 0.305: R6.1 47.15,4.65 46.5,4 46.5,3.5 45,2 25,2 17.5,9.5 17.5,12 15.5,14 15.5,27.5 17.25,29.25 U1.21
M2_6
  Top 0.305: R7.1 51.15,5.65 50.5,5 50.5,3.5 48.5,1.5 24.5,1.5 17,9 17,11.5 15,13.5 15,28 16.25,29.25 16.5,29.5 16.74,29.74 U1.20
M2_7  (via drill 0.6)
  Top 0.305: R8.1 v56.5,5 | U1.29 21.26,29.74 v23,28
  Bottom 0.305: v56.5,5 30,5 23,12 v23,28
M2_8
  Top 0.305: R9.1 34.65,5.15 33.5,4 26,4 19,11 19,13.5 17,15.5 17,26 18.75,27.75 U1.24
M2_9
  Top 0.305: R10.1 23.85,8.15 20,12 20,14.5 18,16.5 18,25 19.76,26.76 U1.26
N$1
  Top 0.406: 88.98,86.98 U3.3 86.32,84.3 84.9,84.3 80.5,79.9 80.5,76.5 78,74 72.13,74 N1.0
N$2
  Top 0.406: U31.3 95,85.5 93,83.5 85,83.5 81.5,80 81.5,76.5 77.5,72.5 76,72.5 74,70.5 74,55.67 N1.2
N$3
  Top 0.406: U4.3 91.98,92.98 91,92 89,92 87,90 87,86.1 85.8,84.9 84.3,84.9 81.6,82.2 75.7,82.2 72.4,78.9 70.2,78.9 64.5,73.2 64.5,64.6 N1.1
N$4
  Top 0.406: U5.3 62,25 65,28 70.4,28 | 70.4,28 70.5,28 | N2.0 71.25,28.85 70.4,28
N$5
  Top 0.406: U6.3 66,14.5 67.5,16 67.5,17.9 71.8,22.2 71.8,28.2 72.6,29 72.6,33.6 77.2,38.2 77.2,43 N2.9
N$6
  Top 0.406: U7.3 73.5,14 77,17.5 77,19 79,21 85.2,21 88,23.8 88,40.18 N2.8
N$7
  Top 0.406: U8.3 87,13.6 88.2,14.8 89.8,14.8 91,16 91,21 90.5,21.5 90.5,37.85 N2.7
N$8
  Top 0.406: U9.3 96,15.52 96,30.19 N2.6
N$9
  Top 0.406: N2.5 93.24,20.44 92,19.2 U10.3
N$10
  Top 0.406: U11.3 82,13 84,15 86.5,15 88,16.5 88,18.86 N2.4
N$11
  Top 0.406: U12.3 77.5,12.5 79,14 79,15.3 N2.3
N$12
  Top 0.406: U13.3 69.5,15.13 N2.2
N$13
  Top 0.406: U14.3 64,19 65.2,20.2 65.2,21.23 N2.1
N$14
  Top 0.406: U15.3 69,85 66,82 35.8,82 33.2,79.4 33.2,74.93 N3.0
N$15
  Top 0.406: U16.3 85,92.5 84,91.5 80,91.5 79,90.5 79,86.4 76.3,83.7 71.7,83.7 65.2,77.2 59.8,77.2 53.2,70.6 53.2,62.6 N3.5
N$16  (via drill 0.6)
  Top 0.406: U17.3 82,86 81.5,85.5 79.2,85.5 76.8,83.1 72.1,83.1 65,76 60.1,76 v55.8,71.7 | N3.4 49.9,55.16 49.9,70.2 50.2,70.5 v51.6,70.5
  Bottom 0.406: v51.6,70.5 54.6,70.5 v55.8,71.7
N$17
  Top 0.406: N3.3 37.24,59 36.5,59 36,59.5 36,70.5 38.5,73 48,73 53,78 65,78 71.5,84.5 76,84.5 78,86.5 78,91 79,92 U18.3
N$18
  Top 0.406: U19.3 72.98,86.98 65,79 53,79 48,74 38,74 35,71 35,55.67 N3.2
N$19
  Top 0.406: U20.3 73,88 65,80 53,80 48,75 38,75 34,71 34,63.53 N3.1
N$20
  Top 0.406: U21.3 23.52,25.02 26.5,28 26.5,34 31,38.5 32.87,38.5 N4.0
N$21
  Top 0.406: U22.3 28.5,18.3 29.2,19 30.2,19 34.6,23.4 34.6,32 39.2,36.6 39.2,43 N4.9
N$22
  Top 0.406: U23.3 37,14.5 39,16.5 39,18.5 42.5,22 46.5,22 50,25.5 50,34 46.5,37.5 46.5,41.61 N4.8
N$23
  Top 0.406: U24.3 57.5,19 59,20.5 59,22.4 60.2,23.6 60.2,33.8 56.5,37.5 54.08,37.5 N4.7
N$24
  Top 0.406: U25.3 53.5,14 56,16.5 56,20 58,22 58,29.89 N4.6
N$25
  Top 0.305: 54,17.5 54,23.33 N4.5
  Top 0.406: U26.3 49.5,13 54,17.5
N$26
  Top 0.305: 45.5,11.5 U27.3
  Top 0.406: 45.5,11.5 50,16 50,18.86 N4.4
N$27
  Top 0.406: U28.3 41.5,13 43,14.5 43,16.74 N4.3
N$28
  Top 0.406: U29.3 32.5,16.13 N4.2
N$29
  Top 0.406: U30.3 25.48,19.02 N4.1
N$30  (via drill 0.6)
  Top 0.305: U1.1 12.24,50.26 11.5,51 v11.5,53.5
  Bottom 0.305: v11.5,53.5 11.5,55.5 13,57 13,67.5 BAT1.1
N$31
  Top 0.305: 6,48.85 Q1.4 6.25,48.75 7.5,50 9.4,50 C1.1 9.6,50 11,50 11.76,49.24 U1.3
N$32
  Top 0.305: U1.4 10.36,48.76 C2.2 8.4,47.9 7.5,47 4.65,47 Q1.1
N$33
  Top 0.305: U1.60 17.25,55.75 17,56 17,57.35 R1.2
  Top 0.406: 17.25,56.9 R1.2
N$34
  Top 0.406: U4.1 92.98,95.02 94,94 94.85,94 R30.2
N$35
  Top 0.406: U31.1 97.83,89.02 R29.2
N$36
  Top 0.406: U3.1 90.02,89.02 91,90 91.85,90 R28.2
N$37
  Top 0.406: R18.2 62.5,14 63,14.5 63,15.95 U14.1
N$38
  Top 0.406: U13.1 68.53,8.88 R19.2
N$39
  Top 0.406: U12.1 76.53,5.88 R20.2
N$40
  Top 0.406: U11.1 81.03,5.88 R21.2
N$41
  Top 0.406: U10.1 91.03,7.38 R22.2
N$42
  Top 0.406: U9.1 95.53,9.88 R23.2
N$43
  Top 0.406: U8.1 86.03,5.88 R24.2
N$44
  Top 0.406: U7.1 72.53,5.88 R25.2
N$45
  Top 0.406: U6.1 65.03,8.88 R26.2
N$46
  Top 0.406: U5.1 61.03,18.39 R27.2
N$47
  Top 0.406: U20.1 73.97,95.97 | 73.97,95.97 74,96 | R17.2 70,96 71,97 72.93,97 73.97,95.97
N$48
  Top 0.406: R16.2 76,92 77,91 77,89.05 U19.1
N$49
  Top 0.406: R15.2 80.83,94.15 U18.1
N$50
  Top 0.406: U17.1 84.83,89.02 R14.2
N$51
  Top 0.406: U16.1 85.98,95.02 87,94 87.85,94 R13.2
N$52
  Top 0.406: U15.1 70,89.05 70,91.85 R12.2
N$53
  Top 0.406: U30.1 23.54,13.88 R2.2
N$54
  Top 0.406: U29.1 31.54,8.38 R3.2
N$55
  Top 0.406: U28.1 40.53,5.88 R4.2
N$56
  Top 0.305: R5.2 44.5,8.95 U27.1
N$57
  Top 0.406: U26.1 48.53,6.38 R6.2
N$58
  Top 0.406: U25.1 52.53,7.38 R7.2
N$59
  Top 0.406: U24.1 56.53,8.38 R8.2
N$60
  Top 0.406: U23.1 36.03,6.88 R9.2
N$61
  Top 0.406: U22.1 27.54,9.88 R10.2
N$62
  Top 0.305: U21.1 21.54,20.89 R11.2
N$63
  Top 0.61: R34.1 64.08,50 67.5,50 69,51.5 69,55.5 72.5,59 72.5,62.2 68.19,66.51 N1.A
N$64
  Top 0.61: R32.1 49.42,50.08 49.42,50.02 49,49.6 36.9,49.6 27.5,59 27.5,61.5 31,65 31,67.24 N3.A
N$67
  Top 0.406: U2.7 23.36,84.64 24,84 R37.2 R36.1
N$68  (via drill 0.8)
  Top 0.61: U2.5 21.46,80.54 v22,80 | v40,91 42,91 43,92 U32.3
  Bottom 0.61: v22,80 23,79 26,79 28,81 28,88 31,91 v40,91
N$69  (via drill 0.8)
  Top 0.61: C12.1 31,86 29,84 R37.1 28,83.85 28,82 27,81 25,81 | 14.63,84.64 U2.2 14.37,84.64 v14,85 | v15,79 19,79 20,78 24,78 24,80 25,81 | U2.6 22.64,83.36 25,81
  Bottom 0.61: v14,85 14,80 v15,79
N$70
  Top 0.61: Q2.G 14.46,91.46 12,89 12,84 12.63,83.36 U2.3
N$71
  Top 0.61: R38.2 18.15,94.85 20,93 | 20,93 Q2.D | 20,93 21,94 27,94 28,95 35.5,95 L1.2 37.5,89.5 41,86 D1.A
N$73
  Top 0.61: R38.1 C10.1
N$74
  Top 0.61: R35.3 57.7,94.69 58,95 59.58,95 R39.1
N$75
  Top 0.61: R35.1 45.7,94.69 45,94 R40.2
N$76
  Top 0.61: R33.1 66.42,43.08 68,41.5 68,32.24 N2.A
N$77
  Top 0.61: U32.1 46.02,96.02 47,97 52,97 53,96 R35.2
N$83
  Top 0.61: N4.A 33.05,32.05 36,35 36,43.8 38.6,46.4 52.6,46.4 56,43 58.92,43 R31.1
NRST  (via drill 0.6)
  Top 0.305: U1.7 15.24,47.26 v17,45.5
  Bottom 0.305: v17,45.5 17.5,45 17.5,44.5 7,34 7,28.5 6.42,27.92 JP1.5
SWCLK  (via drill 0.6)
  Top 0.305: U1.49 22.76,50.76 20,48 17.5,48 v17,47.5
  Bottom 0.305: v17,47.5 16,46.5 16,44 7.54,35.54 JP1.2
SWDIO  (via drill 0.6)
  Top 0.305: U1.46 22.74,49.24 v19,45.5 | JP1.4 7.96,30.46 v8,30.5
  Bottom 0.305: v8,30.5 8,34 19,45 v19,45.5
TEMP  (via drill 0.6)
  Top 0.305: v24.5,36 25.5,36 26,36.5 26,42.5 25.76,42.74 U1.33
  Bottom 0.305: v24.5,36 23.5,37 14.2,37 13.4,36.2 13.4,32 12.2,30.8 JP3.2

### Text on the board
_tsilk: Nixius v1.1 - www.r00li.com